# Altium schematic sheet EPS ARM.SchDoc
size A1; SheetNumber: 1; SheetTotal: 1
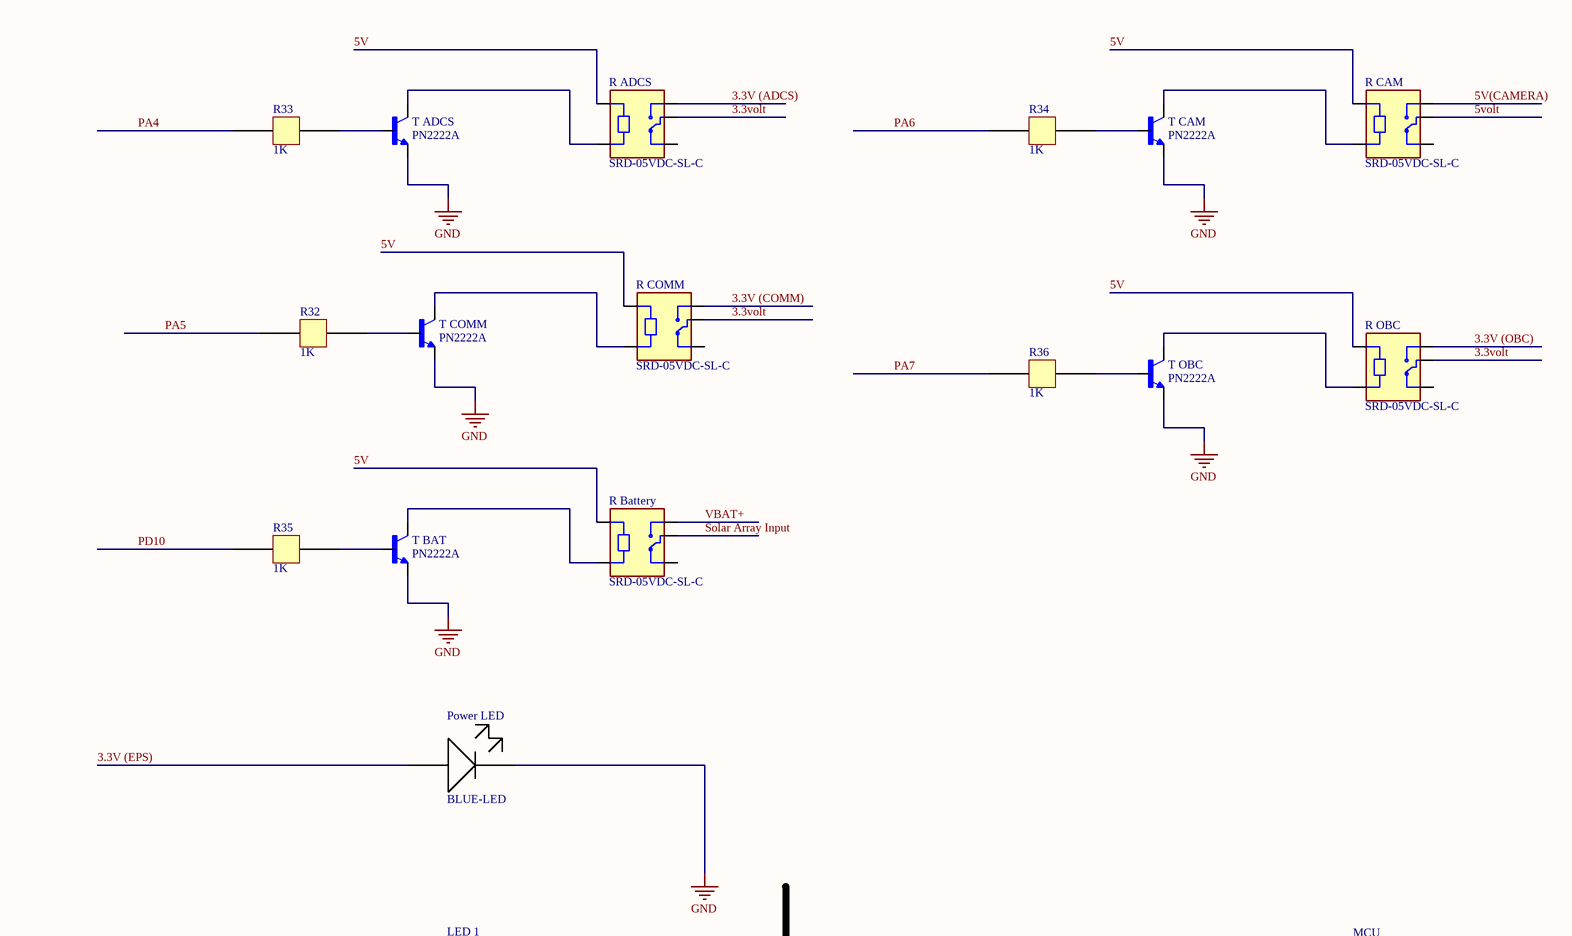
[diagram p0: EPS ARM.SchDoc, top left]
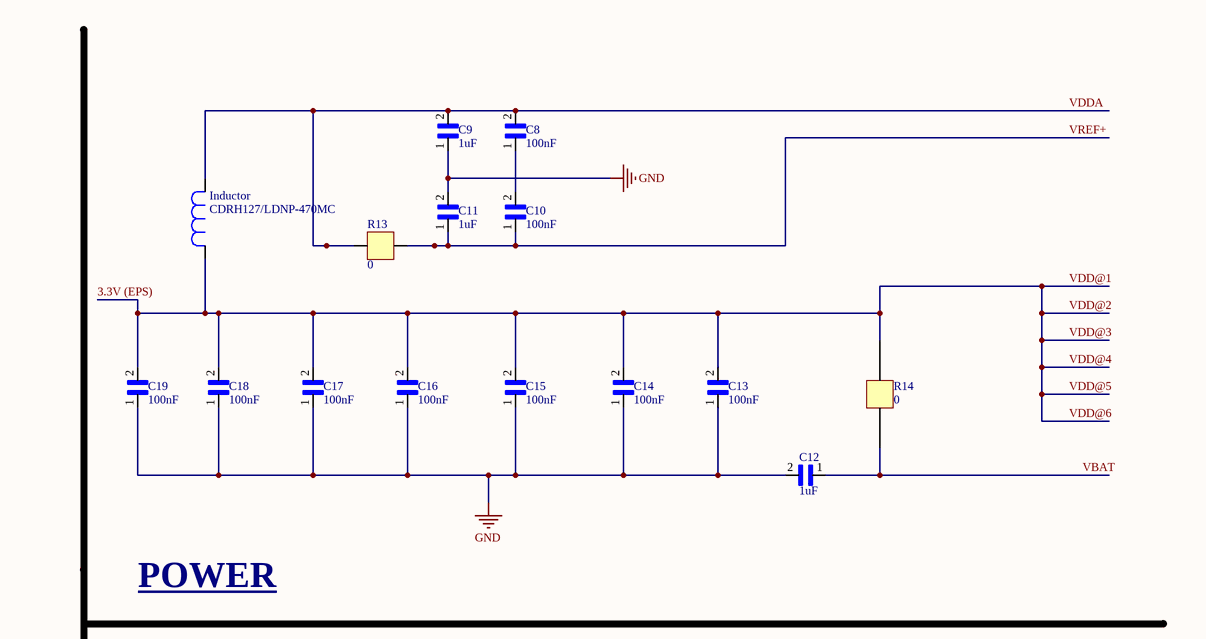
[diagram p1: EPS ARM.SchDoc, top right]
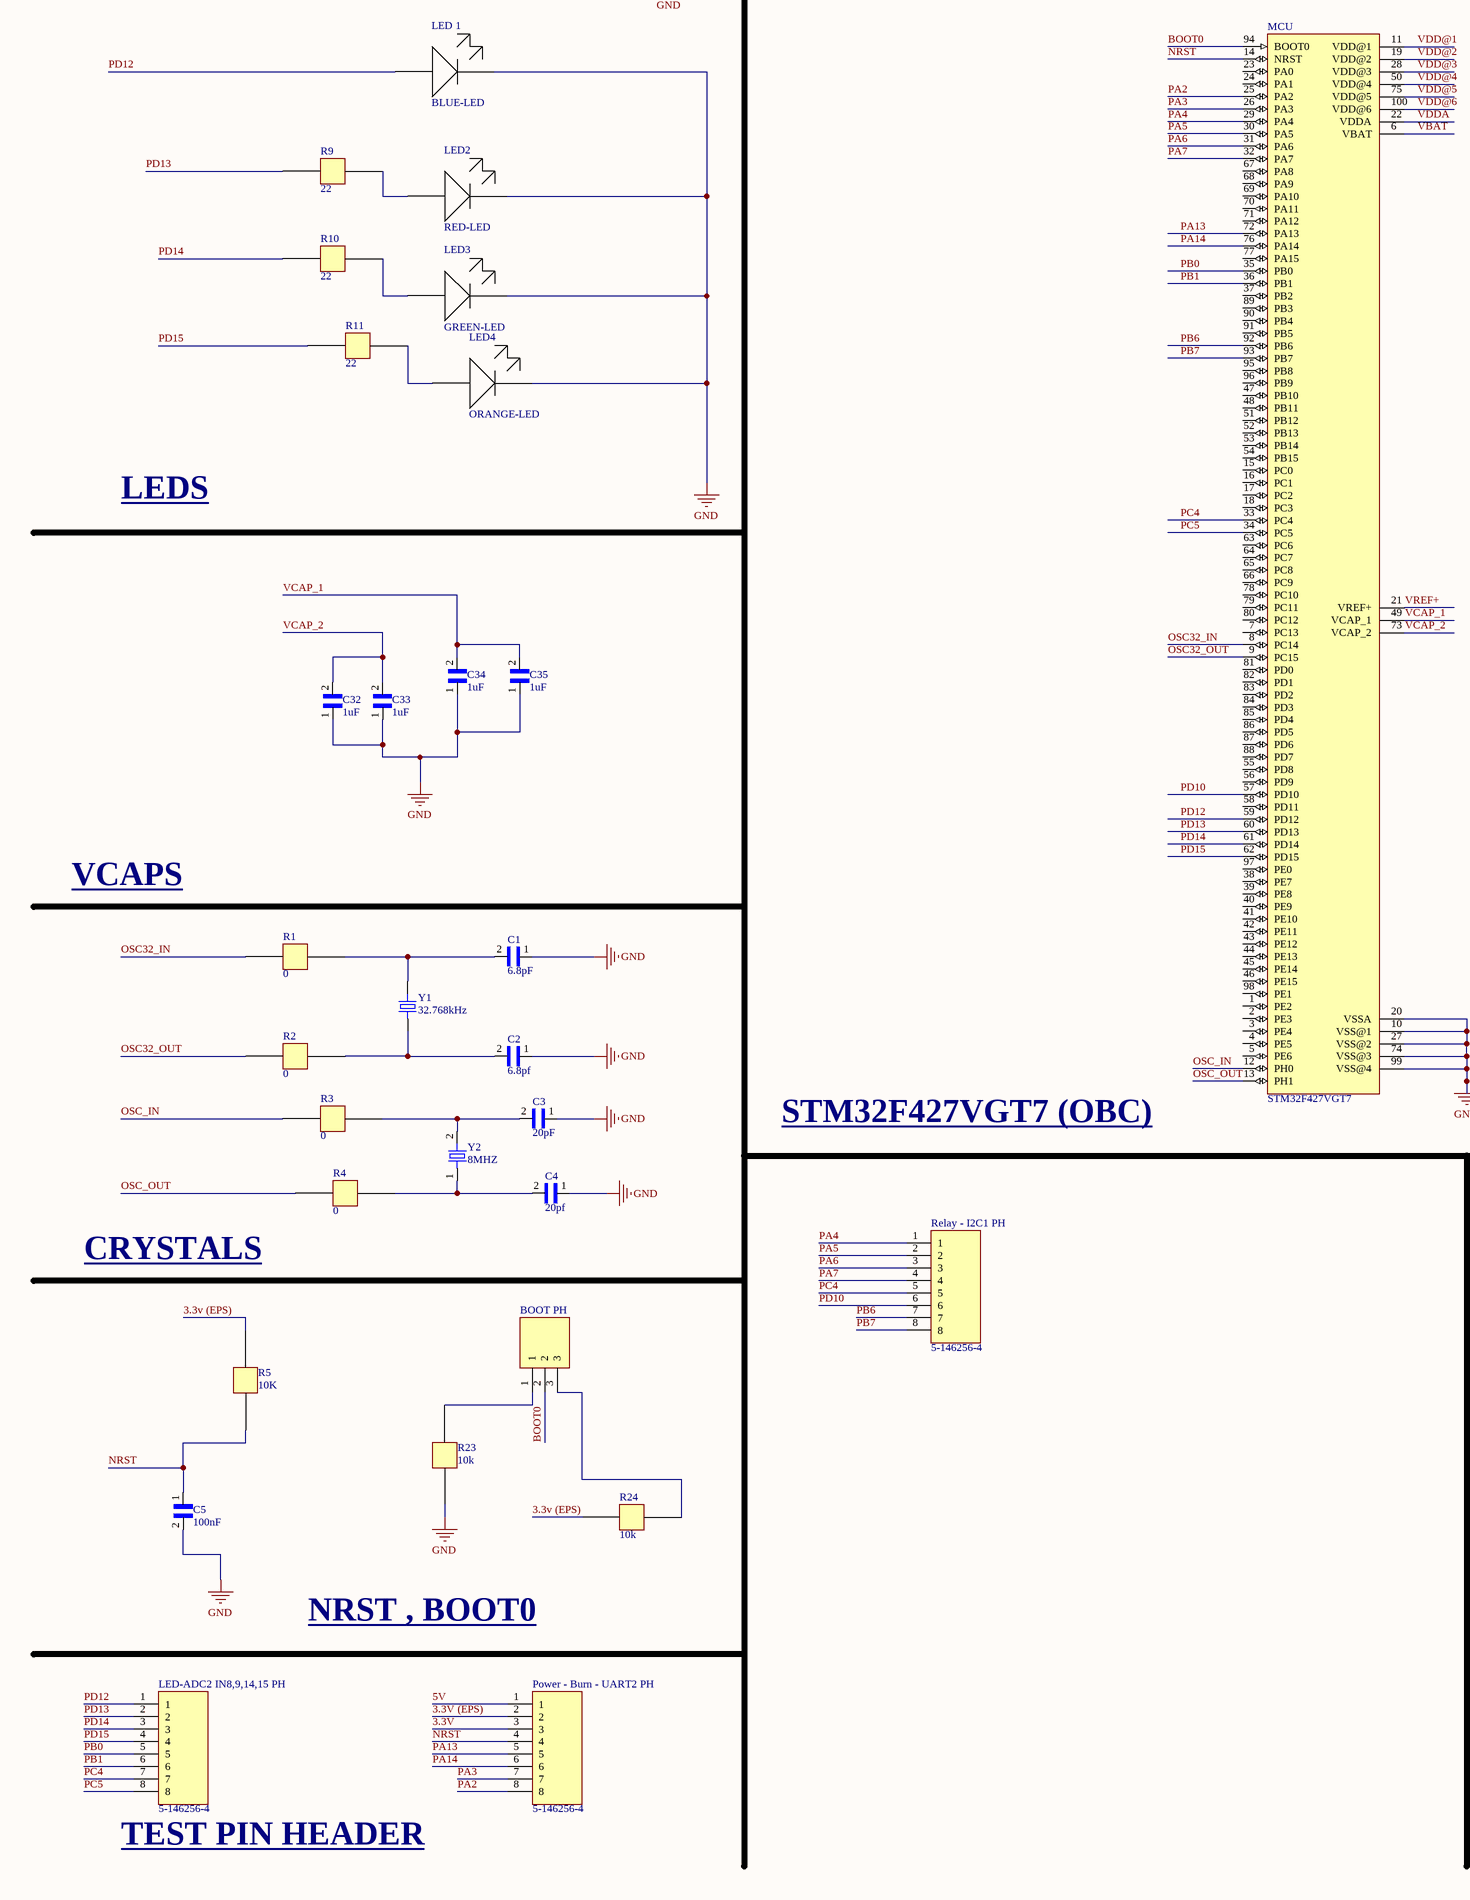
[diagram p2: EPS ARM.SchDoc, bottom left]
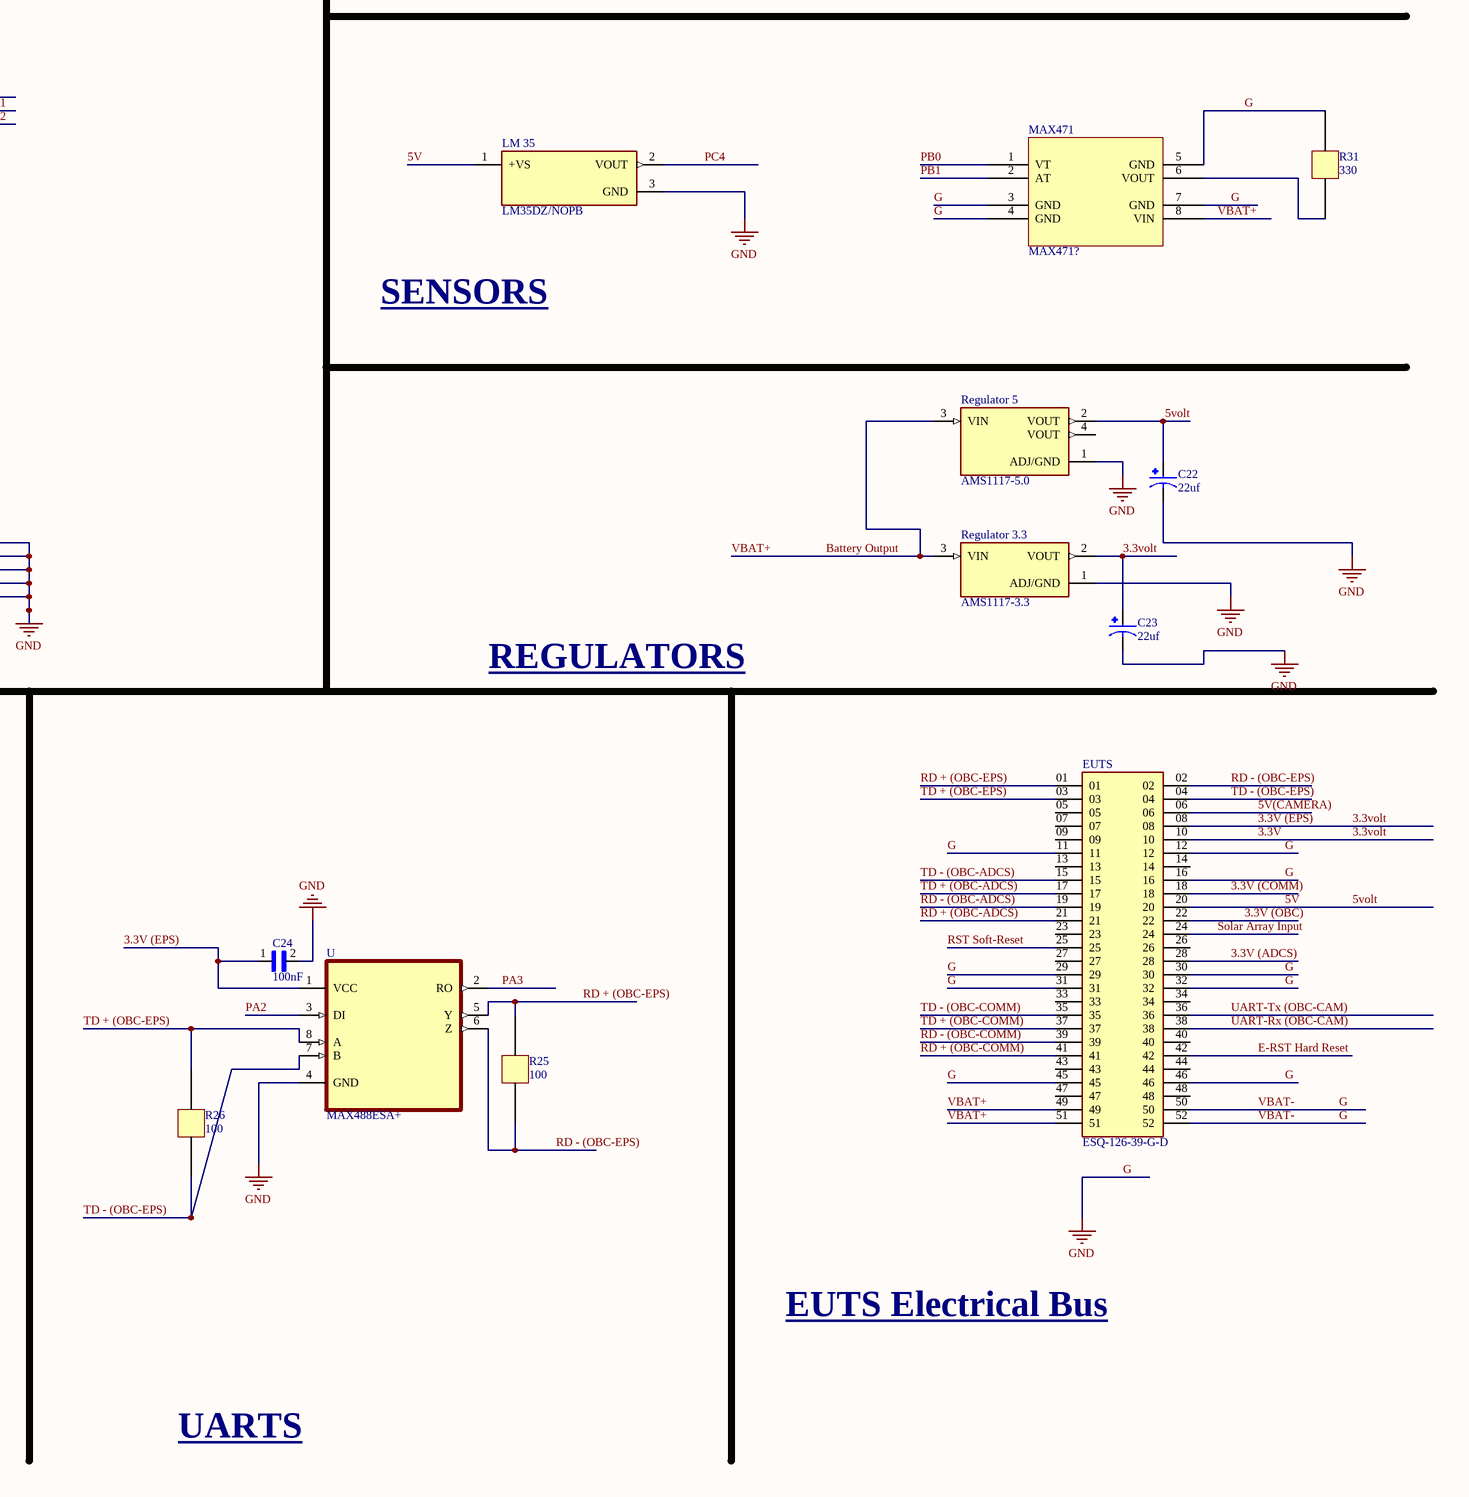
[diagram p3: EPS ARM.SchDoc, bottom right]

## Parts
BOOT_PH  4-103327-5  [TE_4-103327-5]  (value not drawn)
C1  6.8pF  [CAPC2012X95N]
C2  6.8pf  [CAPC2012X95N]
C3  20pF  [CAPC2012X95N]
C4  20pf  [CAPC2012X95N]
C5  100nF  [CAPC2012X95N]
C8  100nF  [CAPC2012X95N]
C9  1uF  [CAPC2012X95N]
C10  100nF  [CAPC2012X95N]
C11  1uF  [CAPC2012X95N]
C12  1uF  [CAPC2012X95N]
C13  100nF  [CAPC2012X95N]
C14  100nF  [CAPC2012X95N]
C15  100nF  [CAPC2012X95N]
C16  100nF  [CAPC2012X95N]
C17  100nF  [CAPC2012X95N]
C18  100nF  [CAPC2012X95N]
C19  100nF  [CAPC2012X95N]
C22  22uf  [CAPPRD350W60D800H1150]
C23  22uf  [CAPPRD350W60D800H1150]
C24  100nF  [CAPC2012X95N]
C32  1uF  [CAPC2012X95N]
C33  1uF  [CAPC2012X95N]
C34  1uF  [CAPC2012X95N]
C35  1uF  [CAPC2012X95N]
EUTS  ESQ-126-39-G-D  [SAMTEC_ESQ-126-39-G-D]
Inductor  CDRH127/LDNP-470MC  [IND_CDRH127/LDNP-470MC_SUM]
LED2  RED-LED  [RESC3015X65]
LED3  GREEN-LED  [RESC3015X65]
LED4  ORANGE-LED  [RESC3015X65]
LED-ADC2_IN8,9,14,15_PH  5-146256-4  [TE_5-146256-4]
LED_1  BLUE-LED  [RESC3015X65]
LM_35  LM35DZ/NOPB  [TO92127P521H735-3]
MAX471  MAX471?  [PCBComponent_1]
MCU  STM32F427VGT7  [QFP50P1600X1600X160-100N]
Power_-_Burn_-_UART2_PH  5-146256-4  [TE_5-146256-4]
Power_LED  BLUE-LED  [RESC3015X65]
R1  0  [CAPC2012X95N]
R2  0  [CAPC2012X95N]
R3  0  [CAPC2012X95N]
R4  0  [CAPC2012X95N]
R5  10K  [CAPC2012X95N]
R9  22  [CAPC2012X95N]
R10  22  [CAPC2012X95N]
R11  22  [CAPC2012X95N]
R13  0  [CAPC2012X95N]
R14  0  [CAPC2012X95N]
R23  10k  [CAPC2012X95N]
R24  10k  [CAPC2012X95N]
R25  100  [CAPC2012X95N]
R26  100  [CAPC2012X95N]
R31  330  [CAPC2012X95N]
R32  1K  [CAPC2012X95N]
R33  1K  [CAPC2012X95N]
R34  1K  [CAPC2012X95N]
R35  1K  [CAPC2012X95N]
R36  1K  [CAPC2012X95N]
R_ADCS  SRD-05VDC-SL-C  [RELAY_MOD]
R_Battery  SRD-05VDC-SL-C  [RELAY_MOD]
R_CAM  SRD-05VDC-SL-C  [RELAY_MOD]
R_COMM  SRD-05VDC-SL-C  [RELAY_MOD]
R_OBC  SRD-05VDC-SL-C  [RELAY_MOD]
Regulator_3.3  AMS1117-3.3  [SOT229P700X180-4N]
Regulator_5  AMS1117-5.0  [SOT229P700X180-4N]
Relay_-_I2C1_PH  5-146256-4  [TE_5-146256-4]
T_ADCS  PN2222A  [TO92127P521H733-3]
T_BAT  PN2222A  [TO92127P521H733-3]
T_CAM  PN2222A  [TO92127P521H733-3]
T_COMM  PN2222A  [TO92127P521H733-3]
T_OBC  PN2222A  [TO92127P521H733-3]
U  MAX488ESA+  [SOIC127P600X175-8N]
Y1  32.768kHz  [XTAL_ECS-.327-12.5-34S-TR]
Y2  8MHZ  [XTAL500X320X130N]

## Nets
G: C1.1 C2.1 C3.1 C4.1 C5.2 C9.1 C11.2 C12.2 C13.1 C14.1 C15.1 C16.1 C17.1 C18.1 C19.1 C22.N C23.N C24.2 C32.1 C33.1 C34.1 C35.1 EUTS.11 EUTS.12 EUTS.16 EUTS.29 EUTS.30 EUTS.31 EUTS.32 EUTS.45 EUTS.46 EUTS.50 EUTS.52 LED2.2 LED3.2 LED4.2 LED_1.2 LM_35.3(GND) MAX471.3(GND) MAX471.4(GND) MAX471.5(GND) MAX471.7(GND) MCU.10(VSS@1) MCU.20(VSSA) MCU.27(VSS@2) MCU.74(VSS@3) MCU.99(VSS@4) Power_LED.2 R23.2 R31.1 Regulator_3.3.1(ADJ/GND) Regulator_5.1(ADJ/GND) T_ADCS.1(E) T_BAT.1(E) T_CAM.1(E) T_COMM.1(E) T_OBC.1(E) U.4(GND)  [also labelled GND, VBAT-]
3.3V: C13.2 C14.2 C15.2 C16.2 C17.2 C18.2 C19.2 C23.P C24.1 EUTS.08 EUTS.10 Inductor.2 MCU.11(VDD@1) MCU.19(VDD@2) MCU.28(VDD@3) MCU.50(VDD@4) MCU.75(VDD@5) MCU.100(VDD@6) Power_-_Burn_-_UART2_PH.2 Power_-_Burn_-_UART2_PH.3 Power_LED.1 R5.1 R14.1 R24.2 R_ADCS.COM R_COMM.COM R_OBC.COM Regulator_3.3.2(VOUT) U.1(VCC)  [also labelled 3.3V (EPS), 3.3volt, VDD@1, VDD@2, VDD@3, VDD@4, VDD@5, VDD@6]
3.3V (ADCS): EUTS.28 R_ADCS.NO
3.3V (COMM): EUTS.18 R_COMM.NO
3.3V (OBC): EUTS.22 R_OBC.NO
5V: C22.P EUTS.20 LM_35.1(+VS) Power_-_Burn_-_UART2_PH.1 R_ADCS.A1 R_Battery.A1 R_CAM.A1 R_CAM.COM R_COMM.A1 R_OBC.A1 Regulator_5.2(VOUT)  [also labelled 5volt]
5V(CAMERA): EUTS.06 R_CAM.NO
Battery Output: EUTS.49 EUTS.51 MAX471.8(VIN) R_Battery.NO Regulator_3.3.3(VIN) Regulator_5.3(VIN)  [also labelled VBAT+]
BOOT0: BOOT_PH.2 MCU.94(BOOT0)
E-RST Hard Reset: EUTS.42
NRST: C5.1 MCU.14(NRST) Power_-_Burn_-_UART2_PH.4 R5.2
OSC32_IN: MCU.8(PC14) R1.2
OSC32_OUT: MCU.9(PC15) R2.2
OSC_IN: MCU.12(PH0) R3.2
OSC_OUT: MCU.13(PH1) R4.2
PA2: MCU.25(PA2) Power_-_Burn_-_UART2_PH.8 U.3(DI)
PA3: MCU.26(PA3) Power_-_Burn_-_UART2_PH.7 U.2(RO)
PA4: MCU.29(PA4) R33.2 Relay_-_I2C1_PH.1
PA5: MCU.30(PA5) R32.2 Relay_-_I2C1_PH.2
PA6: MCU.31(PA6) R34.2 Relay_-_I2C1_PH.3
PA7: MCU.32(PA7) R36.2 Relay_-_I2C1_PH.4
PA13: MCU.72(PA13) Power_-_Burn_-_UART2_PH.5
PA14: MCU.76(PA14) Power_-_Burn_-_UART2_PH.6
PB0: LED-ADC2_IN8,9,14,15_PH.5 MAX471.1(VT) MCU.35(PB0)
PB1: LED-ADC2_IN8,9,14,15_PH.6 MAX471.2(AT) MCU.36(PB1)
PB6: MCU.92(PB6) Relay_-_I2C1_PH.7
PB7: MCU.93(PB7) Relay_-_I2C1_PH.8
PC4: LED-ADC2_IN8,9,14,15_PH.7 LM_35.2(VOUT) MCU.33(PC4) Relay_-_I2C1_PH.5
PC5: LED-ADC2_IN8,9,14,15_PH.8 MCU.34(PC5)
PD10: MCU.57(PD10) R35.2 Relay_-_I2C1_PH.6
PD12: LED-ADC2_IN8,9,14,15_PH.1 LED_1.1 MCU.59(PD12)
PD13: LED-ADC2_IN8,9,14,15_PH.2 MCU.60(PD13) R9.2
PD14: LED-ADC2_IN8,9,14,15_PH.3 MCU.61(PD14) R10.2
PD15: LED-ADC2_IN8,9,14,15_PH.4 MCU.62(PD15) R11.2
RD + (OBC-ADCS): EUTS.21
RD + (OBC-COMM): EUTS.41
RD + (OBC-EPS): EUTS.01 R25.1 U.5(Y)
RD - (OBC-ADCS): EUTS.19
RD - (OBC-COMM): EUTS.39
RD - (OBC-EPS): EUTS.02 R25.2 U.6(Z)
RST Soft-Reset: EUTS.25
Solar Array Input: EUTS.24 R_Battery.COM
TD + (OBC-ADCS): EUTS.17
TD + (OBC-COMM): EUTS.37
TD + (OBC-EPS): EUTS.03 R26.1 U.8(A)
TD - (OBC-ADCS): EUTS.15
TD - (OBC-COMM): EUTS.35
TD - (OBC-EPS): EUTS.04 R26.2 U.7(B)
UART-Rx (OBC-CAM): EUTS.38
UART-Tx (OBC-CAM): EUTS.36
VBAT: C12.1 MCU.6(VBAT) R14.2
VCAP_1: C34.2 C35.2 MCU.49(VCAP_1)
VCAP_2: C32.2 C33.2 MCU.73(VCAP_2)
VDDA: C8.2 C9.2 Inductor.1 MCU.22(VDDA) R13.2
VREF+: C10.1 C11.1 MCU.21(VREF+) R13.1
NetBOOT_PH_1: BOOT_PH.1 R23.1
NetBOOT_PH_3: BOOT_PH.3 R24.1
NetC1_2: C1.2 R1.1 Y1.2(OUT/IN)
NetC2_2: C2.2 R2.1 Y1.1(IN/OUT)
NetC3_2: C3.2 R3.1 Y2.2
NetC4_2: C4.2 R4.1 Y2.1
NetC8_1: C8.1 C10.2
NetLED2_1: LED2.1 R9.1
NetLED3_1: LED3.1 R10.1
NetLED4_1: LED4.1 R11.1
NetMAX471_6: MAX471.6(VOUT) R31.2
NetR32_1: R32.1 T_COMM.2(B)
NetR33_1: R33.1 T_ADCS.2(B)
NetR34_1: R34.1 T_CAM.2(B)
NetR35_1: R35.1 T_BAT.2(B)
NetR36_1: R36.1 T_OBC.2(B)
NetR_ADCS_A2: R_ADCS.A2 T_ADCS.3(C)
NetR_Battery_A2: R_Battery.A2 T_BAT.3(C)
NetR_CAM_A2: R_CAM.A2 T_CAM.3(C)
NetR_COMM_A2: R_COMM.A2 T_COMM.3(C)
NetR_OBC_A2: R_OBC.A2 T_OBC.3(C)

Not connected (* = marked no-connect by the designer): EUTS 05 07 09 13 14 23 26 27 33 34 40 43 44 47 48; MCU 1(PE2) 2(PE3) 3(PE4) 4(PE5) 5(PE6) 7(PC13) 15(PC0) 16(PC1) 17(PC2) 18(PC3) 23(PA0) 24(PA1) 37(PB2) 38(PE7) 39(PE8) 40(PE9) 41(PE10) 42(PE11) 43(PE12) 44(PE13) 45(PE14) 46(PE15) 47(PB10) 48(PB11) 51(PB12) 52(PB13) 53(PB14) 54(PB15) 55(PD8) 56(PD9) 58(PD11) 63(PC6) 64(PC7) 65(PC8) 66(PC9) 67(PA8) 68(PA9) 69(PA10) 70(PA11) 71(PA12) 77(PA15) 78(PC10) 79(PC11) 80(PC12) 81(PD0) 82(PD1) 83(PD2) 84(PD3) 85(PD4) 86(PD5) 87(PD6) 88(PD7) 89(PB3) 90(PB4) 91(PB5) 95(PB8) 96(PB9) 97(PE0) 98(PE1); R_ADCS NC; R_Battery NC; R_CAM NC; R_COMM NC; R_OBC NC; Regulator_5 4(VOUT)

## Notes on the sheet
- LEDS
- POWER
- SENSORS
- VCAPS
- STM32F427VGT7 (OBC)
- REGULATORS
- CRYSTALS
- NRST , BOOT0
- EUTS Electrical Bus
- (near LED-ADC2_IN8,9,14,15_PH) TEST PIN HEADER
- UARTS

## Library data of the parts
BOOT_PH = 4-103327-5: Conn Unshrouded Header HDR 3 POS 2.54mm Solder ST Thru-Hole Carton; MF: TE Connectivity; Package: None; Value: *; TE_purchase_URL: https://www.te.com/usa-en/product-4-103327-5.html?te_bu=Cor&te_type=disp&te_campaign=seda_glo_cor-seda-global-disp-prtnr-fy19-seda-model-bom-cta_sma-317_1&elqCampaignId=32493; Price: None; MP: 4-103327-5; SnapEDA_Link: https://www.snapeda.com/parts/4-103327-5/TE%20Connectivity%20AMP%20Connectors/view-part/2403997/?ref=snap; Availability: Unavailable; EU_RoHS_Compliance: Compliant
C1-C5 C8-C19 C24 C32-C35 = UMK212SD103KD-T: CAP CER 10000PF 50V 0805; Package: None; Price: None; Value: *; MP: UMK212SD103KD-T; Availability: Unavailable
C22 C23 = ECA1HM101: 100ÂµF 50V Aluminum Electrolytic Capacitors Radial, Can 2000 Hrs @ 85Â°C; MF: Panasonic; Check_prices: https://www.snapeda.com/parts/ECA1HM101/Panasonic/view-part/4478734/?ref=eda; SnapEDA_Link: https://www.snapeda.com/parts/ECA1HM101/Panasonic/view-part/4478734/?ref=snap; Price: None; Availability: No availability data; Package: RADIAL-2 Panasonic; MP: ECA1HM101; Value: *
EUTS = ESQ-126-39-G-D: 52 Position Elevated Socket Connector Through Hole; MF: Samtec; Package: None; MP: ESQ-126-39-G-D; Value: *; Availability: Unavailable; Price: None; SnapEDA_Link: https://www.snapeda.com/parts/ESQ-126-39-G-D/Samtec%20Inc./view-part/490181/?ref=snap
Inductor = CDRH127/LDNP-470MC: 47ÂµH Shielded Inductor 3.25A 78mOhm Max Nonstandard; MF: Sumida America; Digi-Key_Part_Number: 308-1339-1-ND; Check_prices: https://www.snapeda.com/parts/CDRH127/LDNP-470MC/Sumida%20America%20Components%20Inc./view-part/547921/?ref=eda; Package: Nonstandard Sumida; Value: *; MP: CDRH127/LDNP-470MC; SnapEDA_Link: https://www.snapeda.com/parts/CDRH127/LDNP-470MC/Sumida%20America%20Components%20Inc./view-part/547921/?ref=snap; Purchase-URL: https://pricing.snapeda.com/search/part/CDRH127/LDNP-470MC/?ref=eda
LED2-LED4 LED_1 Power_LED = LTST-C150TBKT: LED Blue 470nm LED Indication 3.3V
LED-ADC2_IN8,9,14,15_PH Power_-_Burn_-_UART2_PH Relay_-_I2C1_PH = 5-146256-4: 08 MODII HDR DRST B/A .100CL LF; MF: TE Connectivity; Package: None; Availability: Unavailable; Value: *; MP: 5-146256-4; Price: None; SnapEDA_Link: https://www.snapeda.com/parts/5-146256-4/TE%20Connectivity%20AMP%20Connectors/view-part/500529/?ref=snap
LM_35 = LM35DZ/NOPB: Temperature Sensor Analog, Local 0Â°C ~ 100Â°C 10mV/Â°C TO-92-3; MF: Texas Instruments; MP: LM35DZ; Value: *; SnapEDA_Link: https://www.snapeda.com/parts/LM35DZ/Texas+Instruments/view-part/?ref=snap; Price: None; Availability: Not in stock; Package: E-PKG AXIAL-LEADED-2 ON Semiconductor; Check_prices: https://www.snapeda.com/parts/LM35DZ/Texas+Instruments/view-part/?ref=eda
MAX471 = MAX471?: MAX471 Voltage And Current Sensor Module Consume Voltage Load Detection Module
MCU = STM32F427VGT7: ARMÂ® CortexÂ®-M4 STM32F4 Microcontroller IC 32-Bit 180MHz 1MB _1M x 8_ FLASH 100-LQFP _14x14_; MF: STMicroelectronics; Package: LQFP-100 STMicroelectronics; Availability: Unavailable; Value: *; MP: STM32F427VGT7; SnapEDA_Link: https://www.snapeda.com/parts/STM32F427VGT7/STMicroelectronics/view-part/567621/?ref=snap; Price: None
R1-R5 R9-R11 R13 R14 R23-R26 R31-R36 = RESISTOR
R_ADCS R_Battery R_CAM R_COMM R_OBC = SRD-05VDC-SL-C: 5V Trigger Relay Module For Arduino And Raspberry Pi 5V Trigger Relay Module For Arduino And Raspberry Pi; MF: Songle Relay; Package: None; Value: *; Availability: Not in stock; SnapEDA_Link: https://www.snapeda.com/parts/SRD-05VDC-SL-C/Songle+Relay/view-part/?ref=snap; Price: None; MP: SRD-05VDC-SL-C; Check_prices: https://www.snapeda.com/parts/SRD-05VDC-SL-C/Songle+Relay/view-part/?ref=eda
Regulator_3.3 = AMS1117-3.3: Sot223/Pkg 1-Amp 3.3-Volt Low Drop Out Voltage Regulatator; MF: Advanced Monolithic Systems; Price: None; Package: None; Value: *; MP: AMS1117-3.3; Availability: Unavailable; SnapEDA_Link: https://www.snapeda.com/parts/AMS1117-3.3/Advanced%20Monolithic%20Systems/view-part/53450/?ref=snap
Regulator_5 = AMS1117-5.0: Sot223/Pkg 1-Amp 5-Volt Low Drop Out Voltage Regulatator; MF: Advanced Monolithic Systems; Package: None; SnapEDA_Link: https://www.snapeda.com/parts/AMS1117-5.0/Advanced%20Monolithic%20Systems/view-part/184433/?ref=snap; Price: None; Availability: Unavailable; MP: AMS1117-5.0; Value: *
T_ADCS T_BAT T_CAM T_COMM T_OBC = PN2222A: Bipolar _BJT_ Transistor NPN 40V 600mA 270MHz 500mW Through Hole TO-92-3; MF: STMicroelectronics; Package: TO-92 Rectron; Price: None; SnapEDA_Link: https://www.snapeda.com/parts/PN2222A/STMicroelectronics/view-part/1782474/?ref=snap; Availability: Unavailable; Value: *; MP: PN2222A
U = MAX488ESA+: 1/1 Transceiver Full RS422, RS485 8-SOIC; MP: MAX488ESA+T; MF: Maxim Integrated; Price: None; Package: SOIC-8 Maxim; Availability: Unavailable; SnapEDA_Link: https://www.snapeda.com/parts/MAX488ESA+T/Maxim%20Integrated/view-part/48834/?ref=snap; Value: *
Y1 = ECS-.327-12.5-34S-TR: 32.768kHz Â±20ppm Crystal 12.5pF 70 kOhms 2-SMD, No Lead; MF: ECS Inc.; MP: ECS-.327-12.5-34S-TR; Value: *; Availability: Unavailable; SnapEDA_Link: https://www.snapeda.com/parts/ECS-.327-12.5-34S-TR/ECS%20Inc./view-part/2454548/?ref=snap; Price: None; Package: SMD-2 ECS International
Y2 = ABM3-8.000MHZ-D2Y-T: 8MHz Â±20ppm Crystal 18pF 140 Ohms 2-SMD, No Lead; MF: Abracon; Value: *; MP: ABM3-8.000MHZ-D2Y-T; SnapEDA_Link: https://www.snapeda.com/parts/ABM3-8.000MHZ-D2Y-T/Abracon%20LLC/view-part/106372/?ref=snap; Package: SMD-2 Abracon; Digi-Key_Part_Number: 535-10630-1-ND; Digi-Key_Purchase_URL: https://www.digikey.com/product-detail/en/abracon-llc/ABM3-8.000MHZ-D2Y-T/535-10630-1-ND/2344632?utm_source=snapeda&utm_medium=aggregator&utm_campaign=symbol